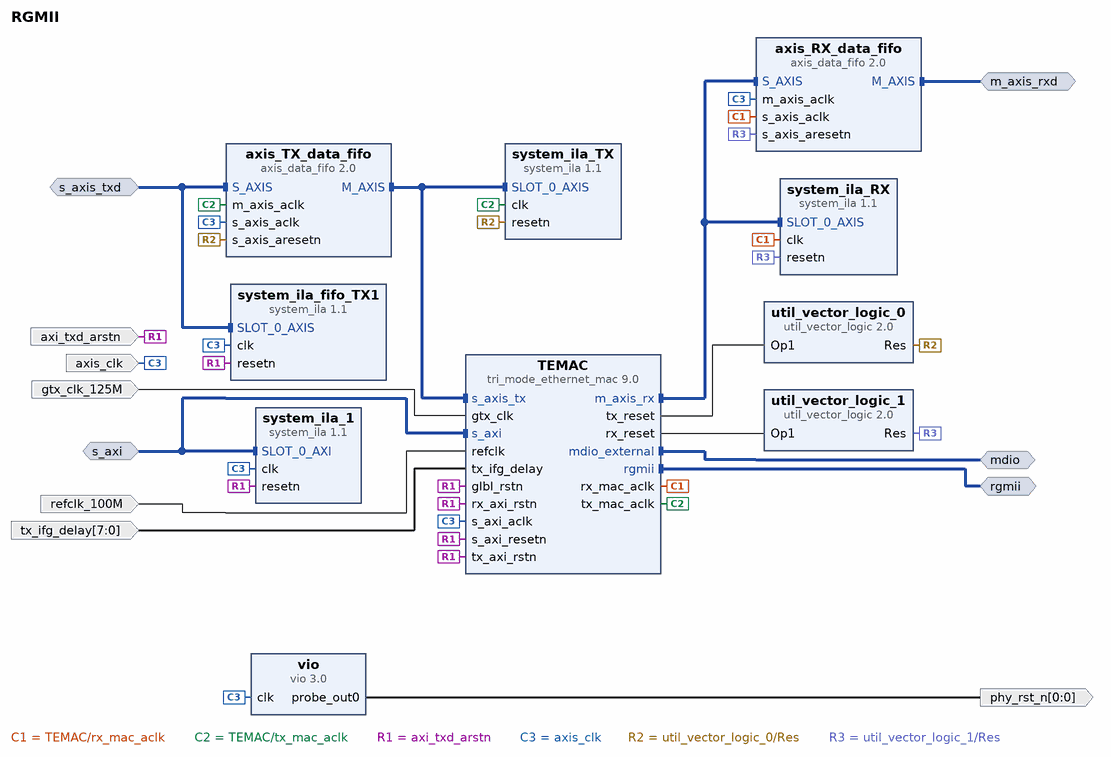
[diagram p0: block diagram of the top level]
# Vivado block design RGMII, xczu9eg-ffvb1156-2-i, Vivado 2024.2.2
create_bd_design RGMII

create_bd_intf_port -mode Slave -vlnv xilinx.com:interface:aximm_rtl:1.0 s_axi
set_property -dict [list \
  CONFIG.ADDR_WIDTH 18 \
  CONFIG.ARUSER_WIDTH 0 \
  CONFIG.AWUSER_WIDTH 0 \
  CONFIG.BUSER_WIDTH 0 \
  CONFIG.DATA_WIDTH 32 \
  CONFIG.FREQ_HZ 100000000 \
  CONFIG.HAS_BRESP 1 \
  CONFIG.HAS_BURST 0 \
  CONFIG.HAS_CACHE 0 \
  CONFIG.HAS_LOCK 0 \
  CONFIG.HAS_PROT 0 \
  CONFIG.HAS_QOS 0 \
  CONFIG.HAS_REGION 0 \
  CONFIG.HAS_RRESP 1 \
  CONFIG.HAS_WSTRB 1 \
  CONFIG.ID_WIDTH 0 \
  CONFIG.NUM_READ_OUTSTANDING 1 \
  CONFIG.NUM_READ_THREADS 1 \
  CONFIG.NUM_WRITE_OUTSTANDING 1 \
  CONFIG.NUM_WRITE_THREADS 1 \
  CONFIG.PROTOCOL AXI4LITE \
  CONFIG.READ_WRITE_MODE READ_WRITE \
  CONFIG.RUSER_BITS_PER_BYTE 0 \
  CONFIG.RUSER_WIDTH 0 \
  CONFIG.WUSER_BITS_PER_BYTE 0 \
  CONFIG.WUSER_WIDTH 0 \
] [get_bd_intf_ports s_axi]
create_bd_intf_port -mode Master -vlnv xilinx.com:interface:rgmii_rtl:1.0 rgmii
create_bd_intf_port -mode Master -vlnv xilinx.com:interface:axis_rtl:1.0 m_axis_rxd
set_property -dict {CONFIG.FREQ_HZ 100000000} [get_bd_intf_ports m_axis_rxd]
create_bd_intf_port -mode Slave -vlnv xilinx.com:interface:axis_rtl:1.0 s_axis_txd
set_property -dict [list \
  CONFIG.FREQ_HZ 100000000 \
  CONFIG.HAS_TKEEP 1 \
  CONFIG.HAS_TLAST 1 \
  CONFIG.HAS_TREADY 1 \
  CONFIG.HAS_TSTRB 0 \
  CONFIG.LAYERED_METADATA undef \
  CONFIG.TDATA_NUM_BYTES 1 \
  CONFIG.TDEST_WIDTH 0 \
  CONFIG.TID_WIDTH 0 \
  CONFIG.TUSER_WIDTH 1 \
] [get_bd_intf_ports s_axis_txd]
create_bd_intf_port -mode Master -vlnv xilinx.com:interface:mdio_io:1.0 mdio
create_bd_port -dir I -type clk axis_clk
set_property -dict {CONFIG.ASSOCIATED_BUSIF s_axi:s_axis_txd:m_axis_rxd CONFIG.FREQ_HZ 100000000} [get_bd_ports axis_clk]
create_bd_port -dir I -type clk gtx_clk_125M
set_property -dict {CONFIG.FREQ_HZ 125000000 CONFIG.PHASE 0} [get_bd_ports gtx_clk_125M]
create_bd_port -dir I -type rst axi_txd_arstn
create_bd_port -dir I -from 7 -to 0 tx_ifg_delay
create_bd_port -dir O -from 0 -to 0 phy_rst_n
create_bd_port -dir I -type clk refclk_100M
set_property -dict {CONFIG.FREQ_HZ 333333333} [get_bd_ports refclk_100M]

create_bd_cell -type ip -vlnv xilinx.com:ip:tri_mode_ethernet_mac:9.0 TEMAC
set_property -dict [list \
  CONFIG.Data_Rate 1_Gbps \
  CONFIG.Enable_MDIO true \
  CONFIG.Enable_Priority_Flow_Control false \
  CONFIG.MAC_Speed 1000_Mbps \
  CONFIG.Make_MDIO_External true \
  CONFIG.Management_Frequency 100 \
  CONFIG.Management_Interface true \
  CONFIG.Physical_Interface RGMII \
  CONFIG.Statistics_Width 64bit \
  CONFIG.SupportLevel 1 \
] [get_bd_cells TEMAC]
create_bd_cell -type ip -vlnv xilinx.com:ip:util_vector_logic:2.0 util_vector_logic_0
set_property -dict {CONFIG.C_OPERATION not CONFIG.C_SIZE 1} [get_bd_cells util_vector_logic_0]
create_bd_cell -type ip -vlnv xilinx.com:ip:util_vector_logic:2.0 util_vector_logic_1
set_property -dict {CONFIG.C_OPERATION not CONFIG.C_SIZE 1} [get_bd_cells util_vector_logic_1]
create_bd_cell -type ip -vlnv xilinx.com:ip:vio:3.0 vio
set_property -dict {CONFIG.C_NUM_PROBE_IN 0 CONFIG.C_NUM_PROBE_OUT 1} [get_bd_cells vio]
create_bd_cell -type ip -vlnv xilinx.com:ip:axis_data_fifo:2.0 axis_TX_data_fifo
set_property -dict [list \
  CONFIG.FIFO_DEPTH 512 \
  CONFIG.FIFO_MEMORY_TYPE block \
  CONFIG.FIFO_MODE 2 \
  CONFIG.IS_ACLK_ASYNC 1 \
  CONFIG.SYNCHRONIZATION_STAGES 5 \
] [get_bd_cells axis_TX_data_fifo]
create_bd_cell -type ip -vlnv xilinx.com:ip:system_ila:1.1 system_ila_1
create_bd_cell -type ip -vlnv xilinx.com:ip:system_ila:1.1 system_ila_TX
set_property -dict [list \
  CONFIG.C_DATA_DEPTH 4096 \
  CONFIG.C_SLOT_0_INTF_TYPE xilinx.com:interface:axis_rtl:1.0 \
] [get_bd_cells system_ila_TX]
create_bd_cell -type ip -vlnv xilinx.com:ip:axis_data_fifo:2.0 axis_RX_data_fifo
set_property -dict {CONFIG.FIFO_DEPTH 1024 CONFIG.FIFO_MEMORY_TYPE block CONFIG.IS_ACLK_ASYNC 1} [get_bd_cells axis_RX_data_fifo]
create_bd_cell -type ip -vlnv xilinx.com:ip:system_ila:1.1 system_ila_RX
set_property -dict [list \
  CONFIG.C_DATA_DEPTH 4096 \
  CONFIG.C_SLOT_0_INTF_TYPE xilinx.com:interface:axis_rtl:1.0 \
] [get_bd_cells system_ila_RX]
create_bd_cell -type ip -vlnv xilinx.com:ip:system_ila:1.1 system_ila_fifo_TX1
set_property -dict [list \
  CONFIG.C_DATA_DEPTH 4096 \
  CONFIG.C_SLOT_0_INTF_TYPE xilinx.com:interface:axis_rtl:1.0 \
] [get_bd_cells system_ila_fifo_TX1]

# ---- connections ----

connect_bd_intf_net [get_bd_intf_pins axis_RX_data_fifo/S_AXIS] [get_bd_intf_pins TEMAC/m_axis_rx]
connect_bd_intf_net [get_bd_intf_pins axis_RX_data_fifo/S_AXIS] [get_bd_intf_pins system_ila_RX/SLOT_0_AXIS]
connect_bd_intf_net [get_bd_intf_ports mdio] [get_bd_intf_pins TEMAC/mdio_external]
connect_bd_intf_net [get_bd_intf_ports rgmii] [get_bd_intf_pins TEMAC/rgmii]
connect_bd_intf_net -intf_net axis_TX_data_fifo1_M_AXIS [get_bd_intf_ports m_axis_rxd] [get_bd_intf_pins axis_RX_data_fifo/M_AXIS]
connect_bd_intf_net -intf_net axis_dwidth_converter_0_M_AXIS [get_bd_intf_pins TEMAC/s_axis_tx] [get_bd_intf_pins axis_TX_data_fifo/M_AXIS]
connect_bd_intf_net [get_bd_intf_pins TEMAC/s_axis_tx] [get_bd_intf_pins system_ila_TX/SLOT_0_AXIS]
connect_bd_intf_net [get_bd_intf_ports s_axi] [get_bd_intf_pins TEMAC/s_axi]
connect_bd_intf_net [get_bd_intf_ports s_axi] [get_bd_intf_pins system_ila_1/SLOT_0_AXI]
connect_bd_intf_net [get_bd_intf_ports s_axis_txd] [get_bd_intf_pins axis_TX_data_fifo/S_AXIS]
connect_bd_intf_net [get_bd_intf_ports s_axis_txd] [get_bd_intf_pins system_ila_fifo_TX1/SLOT_0_AXIS]
connect_bd_net [get_bd_pins TEMAC/rx_mac_aclk] [get_bd_pins system_ila_RX/clk] [get_bd_pins axis_RX_data_fifo/s_axis_aclk]
connect_bd_net [get_bd_pins TEMAC/rx_reset] [get_bd_pins util_vector_logic_1/Op1]
connect_bd_net [get_bd_pins TEMAC/tx_mac_aclk] [get_bd_pins axis_TX_data_fifo/m_axis_aclk] [get_bd_pins system_ila_TX/clk]
connect_bd_net [get_bd_pins TEMAC/tx_reset] [get_bd_pins util_vector_logic_0/Op1]
connect_bd_net [get_bd_ports axi_txd_arstn] \
  [get_bd_pins TEMAC/s_axi_resetn] [get_bd_pins TEMAC/rx_axi_rstn] [get_bd_pins TEMAC/tx_axi_rstn] \
  [get_bd_pins TEMAC/glbl_rstn] [get_bd_pins system_ila_1/resetn] [get_bd_pins system_ila_fifo_TX1/resetn]
connect_bd_net [get_bd_ports axis_clk] \
  [get_bd_pins TEMAC/s_axi_aclk] [get_bd_pins vio/clk] [get_bd_pins axis_TX_data_fifo/s_axis_aclk] \
  [get_bd_pins system_ila_1/clk] [get_bd_pins axis_RX_data_fifo/m_axis_aclk] [get_bd_pins system_ila_fifo_TX1/clk]
connect_bd_net [get_bd_ports gtx_clk_125M] [get_bd_pins TEMAC/gtx_clk]
connect_bd_net -net phy_rst_n [get_bd_pins vio/probe_out0] [get_bd_ports phy_rst_n]
connect_bd_net -net refclk_0_1 [get_bd_ports refclk_100M] [get_bd_pins TEMAC/refclk]
connect_bd_net -net tx_ifg_delay_0_1 [get_bd_ports tx_ifg_delay] [get_bd_pins TEMAC/tx_ifg_delay]
connect_bd_net [get_bd_pins util_vector_logic_0/Res] [get_bd_pins axis_TX_data_fifo/s_axis_aresetn] [get_bd_pins system_ila_TX/resetn]
connect_bd_net [get_bd_pins util_vector_logic_1/Res] [get_bd_pins axis_RX_data_fifo/s_axis_aresetn] [get_bd_pins system_ila_RX/resetn]

# ---- address map ----
assign_bd_address -offset 0x00000 -range 4K -target_address_space [get_bd_addr_spaces s_axi] [get_bd_addr_segs TEMAC/s_axi/Reg]

validate_bd_design
save_bd_design
